# Altium project Tone Control.PrjPcb
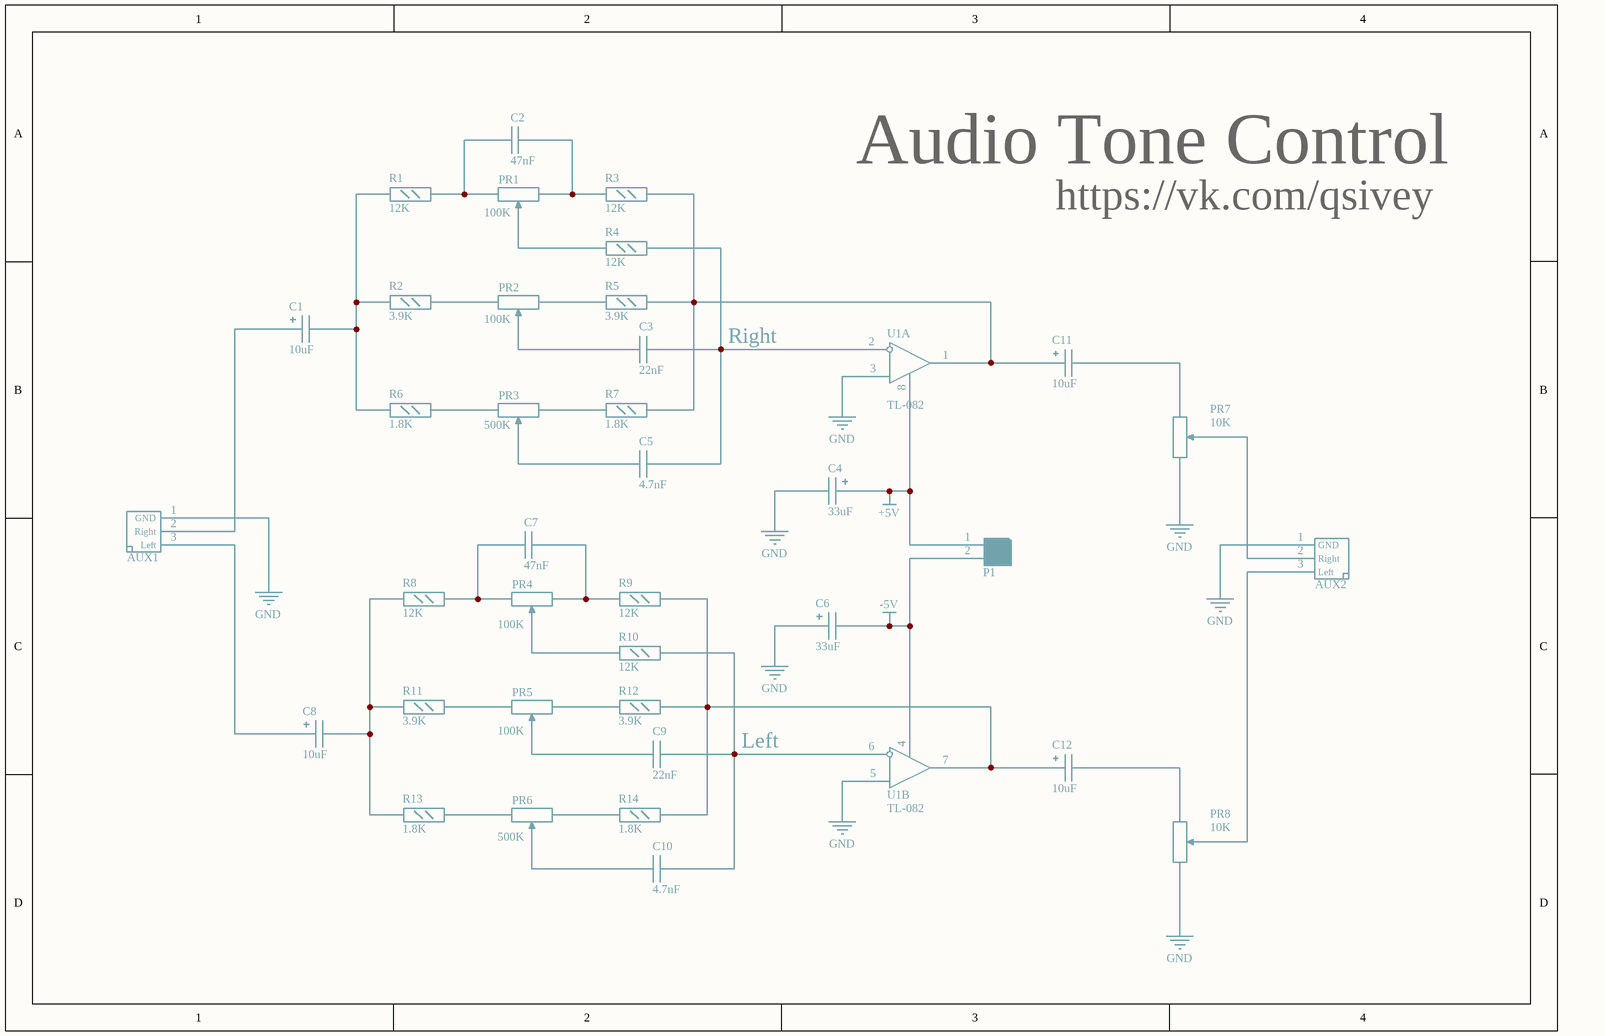
[diagram p0: ToneControl.SchDoc]
1 sheet, 38 parts. Net scope: global (net labels, ports and power ports of the same name join across sheets).
Board files: ToneControl.PcbDoc, ToneControl 2.PcbDoc

## Sheet ToneControl.SchDoc
size A4

### Parts
AUX1  AUX  [AUX_2]  (value not drawn)
AUX2  AUX  [AUX_2]  (value not drawn)
C1  10uF  [CAP_POL_MED]
C2  47nF  [CAP_CER_MED]
C3  22nF  [CAP_CER_MED]
C4  33uF  [CAP_POL_MED]
C5  4.7nF  [CAP_CER_MED]
C6  33uF  [CAP_POL_MED]
C7  47nF  [CAP_CER_MED]
C8  10uF  [CAP_POL_MED]
C9  22nF  [CAP_CER_MED]
C10  4.7nF  [CAP_CER_MED]
C11  10uF  [CAP_POL_MED]
C12  10uF  [CAP_POL_MED]
P1  Header_2  [HEADER2]  (value not drawn)
PR1  100K  [REOSTAT_CUS]
PR2  100K  [REOSTAT_CUS]
PR3  500K  [REOSTAT_CUS]
PR4  100K  [REOSTAT_CUS]
PR5  100K  [REOSTAT_CUS]
PR6  500K  [REOSTAT_CUS]
PR7  10K  [REOSTAT_CUS]
PR8  10K  [REOSTAT_CUS]
R1  12K  [RES_MED]
R2  3.9K  [RES_MED]
R3  12K  [RES_MED]
R4  12K  [RES_MED]
R5  3.9K  [RES_MED]
R6  1.8K  [RES_MED]
R7  1.8K  [RES_MED]
R8  12K  [RES_MED]
R9  12K  [RES_MED]
R10  12K  [RES_MED]
R11  3.9K  [RES_MED]
R12  3.9K  [RES_MED]
R13  1.8K  [RES_MED]
R14  1.8K  [RES_MED]
U1  TL-082  [DIP8]  (parts A,B of 2)

### Nets
+5V: C4.1 P1.1 U1.8
-5V: C6.2 P1.2 U1.4
GND: AUX1.1(GND) AUX2.1(GND) C4.2 C6.1 PR7.3 PR8.3 U1.3 U1.5
NetAUX1_2: AUX1.2(Right) C1.1
NetAUX1_3: AUX1.3(Left) C8.1
NetAUX2_2: AUX2.2(Right) PR7.2
NetAUX2_3: AUX2.3(Left) PR8.2
NetC1_2: C1.2 R1.1 R2.1 R6.1
NetC2_1: C2.1 PR1.3 R1.2
NetC2_2: C2.2 PR1.1 R3.1
NetC3_1: C3.1 PR2.2
NetC3_2: C3.2 C5.2 R4.2 U1.2
NetC5_1: C5.1 PR3.2
NetC7_1: C7.1 PR4.3 R8.2
NetC7_2: C7.2 PR4.1 R9.1
NetC8_2: C8.2 R8.1 R11.1 R13.1
NetC9_1: C9.1 PR5.2
NetC9_2: C9.2 C10.2 R10.2 U1.6
NetC10_1: C10.1 PR6.2
NetC11_1: C11.1 R3.2 R5.2 R7.2 U1.1
NetC11_2: C11.2 PR7.1
NetC12_1: C12.1 R9.2 R12.2 R14.2 U1.7
NetC12_2: C12.2 PR8.1
NetPR1_2: PR1.2 R4.1
NetPR2_1: PR2.1 R5.1
NetPR2_3: PR2.3 R2.2
NetPR3_1: PR3.1 R7.1
NetPR3_3: PR3.3 R6.2
NetPR4_2: PR4.2 R10.1
NetPR5_1: PR5.1 R12.1
NetPR5_3: PR5.3 R11.2
NetPR6_1: PR6.1 R14.1
NetPR6_3: PR6.3 R13.2

### Notes on the sheet
- Audio Tone Control
- https://vk.com/qsivey
- Right
- Left

### Library data of the parts
C1 C4 C6 C8 C11 C12 = Cap_Pol
  C1 C8 C11 C12: Value: 10uF
  C4 C6: Value: 33uF
C2 C3 C5 C7 C9 C10 = Cap_Ceram
  C2 C7: Value: 47nF
  C3 C9: Value: 22nF
  C5 C10: Value: 4.7nF
PR1-PR8 = Reostat
  PR1 PR2 PR4 PR5: Value: 100K
  PR3 PR6: Value: 500K
  PR7 PR8: Value: 10K
R1-R14 = Res
  R1 R3 R4 R8-R10: Value: 12K
  R2 R5 R11 R12: Value: 3.9K
  R6 R7 R13 R14: Value: 1.8K
U1 = OpAmp_8: Name: TL-082